# Altium schematic sheet RS485.SchDoc: Name project title here
size A3; Organization: Krakul OÜ; Address1: Kaare tee 3, lubja; Address2: viimsi vald; Address3: harju maakond; Address4: Estonia 74010; DocumentNumber: No here; Revision: 0; SheetNumber: 3; SheetTotal: 7
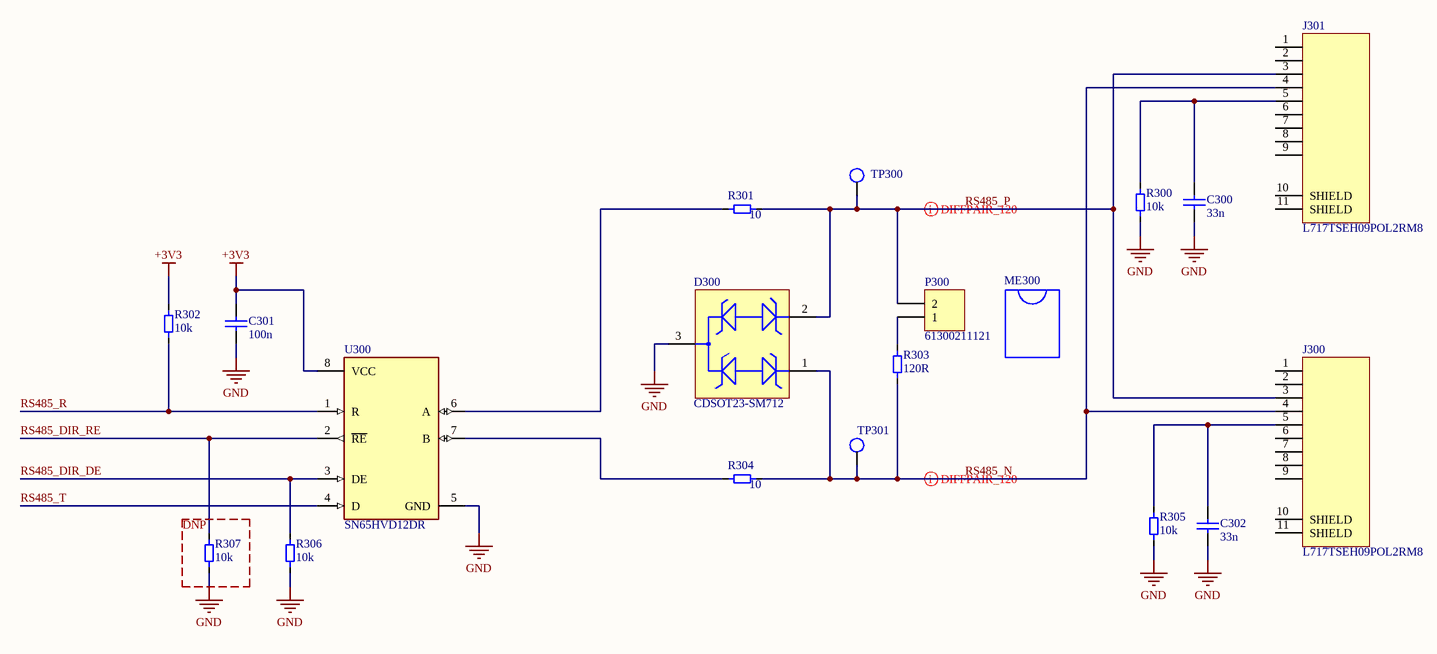
[diagram p0: RS485.SchDoc]

## Parts
C300  33n  [MLCC_0805_M]
C301  100n  [MLCC_0402_M]
C302  33n  [MLCC_0805_M]
D300  CDSOT23-SM712  [FP-SOT23-MFG]
J300  L717TSEH09POL2RM8  [L717TSEH09POL2RM8-Footprint-1]
J301  L717TSEH09POL2RM8  [L717TSEH09POL2RM8-Footprint-1]
ME300  SNT-100-BK-T-H  [SNT-100-BK-T-H-Footprint-1]  (value not drawn)
P300  61300211121  [61300211121]
R300  10k  [Resistor_0603_M]
R301  value 10  [Resistor_0603_M]  (hidden comment: CRCW0603010RJNEAHP)
R302  10k  [Resistor_0603_M]
R303  120R  [Resistor_0805_M]
R304  value 10  [Resistor_0603_M]  (hidden comment: CRCW0603010RJNEAHP)
R305  10k  [Resistor_0603_M]
R306  10k  [Resistor_0603_M]
R307  10k  [Resistor_0603_M]
TP300  Testpoint 1mm  [Testpoint 1mm]  (value not drawn)  (no BOM)
TP301  Testpoint 1mm  [Testpoint 1mm]  (value not drawn)  (no BOM)
U300  SN65HVD12DR  [FP-D0008A-IPC_B]

## Blocks framed on the sheet
DNP: R307

## Nets
+3V3: C301.2 R302.2 U300.8(VCC)
GND: C300.1 C301.1 C302.1 D300.3 R300.1 R305.1 R306.1 R307.1 U300.5(GND)
RS485_DIR_DE: R306.2 U300.3(DE)
RS485_DIR_RE: R307.2 U300.2(~{RE})
RS485_N: D300.1 J300.4 J301.4 R303.1 R304.2 TP301.1
RS485_P: D300.2 J300.3 J301.3 P300.2 R301.2 TP300.1
RS485_R: R302.1 U300.1(R)
RS485_T: U300.4(D)
NetC300_2: C300.2 J301.5 R300.2
NetC302_2: C302.2 J300.5 R305.2
NetP300_1: P300.1 R303.2
NetR301_1: R301.1 U300.6(A)
NetR304_1: R304.1 U300.7(B)

Not connected (* = marked no-connect by the designer): J300 1 2 6 7 8 9 10(SHIELD) 11(SHIELD); J301 1 2 6 7 8 9 10(SHIELD) 11(SHIELD)

## Layout directives
differential pair: RS485_N, RS485_P

## Notes on the sheet
- Title:
- Date:
- Last modified:
- Project:
- Sheet
- Time:
- of
- Size:
- A3
- Engineer:
- Revision:
- Revision date:
- Checked by:

## Library data of the parts
C300 C302 = CMP-001-1076-2: MLCC, 0805, 33n, 10%, 50V, X7R; Manufacturer: Any; Capacitor Type: Ceramic; Value: 33nF; Case/Package: 0805; Part number: MLCC, 0805, 33n, 10%, 50V, X7R; Dielectric: X7R; Voltage: 50V; Tolerance: 10%; RoHS: Yes; Mount: SMD
C301 = CMP-001-1256-2: MLCC, 0402, 100n, 10%, 10V, X5R; Manufacturer: Any; Capacitor Type: Ceramic; Value: 100nF; Case/Package: 0402; Part number: MLCC, 0402, 100n, 10%, 10V, X5R; RoHS: Yes; Tolerance: 10%; Mount: SMD; Voltage: 10V; Dielectric: X5R
D300 = CMP-ROOT-00649-3: BOURNS - CDSOT23-SM712 - Transient Voltage Suppressor, TVS, CDSOT23 Series, Unidirectional, 12 V, SOT-23, 3, 13.3 V; Manufacturer: Bourns Inc.; Power Line Protection: No; Peak Pulse Current: 17A; Number of Channels: 2; Peak Pulse Power: 400W; Reverse Standoff Voltage: 12V; Reverse Breakdown Voltage: 13.3V; Test Current: 1mA; Capacitance: 75pF; Direction: Bidirectional; Leakage Current: 20uA; Max Power Dissipation: 600W; ESD Protection: Yes; Clamping Voltage: 26V; Element Configuration: Dual; Max Surge Current: 30A; Polarity: Bidirectional,Unidirectional; Width: 0.055inch; Packaging: Tape and Reel; Termination: SMD/SMT; Height: 1.11mm; Radiation Hardening: No; Max Operating Temperature: 150°C; Length: 3.04mm; Case/Package: SOT-23; Number of Pins: 3; Min Breakdown Voltage: 13.3V; RoHS: Yes; Part number: CDSOT23-SM712; Depth: 1.4mm; Number of Bidirectional Channels: 2; REACH SVHC: No SVHC; Min Operating Temperature: -55°C; Package Quantity: 1; Resistor Type: Zener; Contact Plating: Tin; Mount: Surface Mount; Breakdown Voltage: 13.3V; Number of Elements: 2; Max Breakdown Voltage: 13.3V; Working Voltage: 12V; Max Reverse Leakage Current: 20uA; Power Dissipation: 400W
J300 J301 = CMP-ROOT-01058-3: Conn D-Subminiature PIN 9 POS 1.37mm Solder ST Thru-Hole 9 Terminal 1 Port; Manufacturer: Amphenol ICC; Gender: Male, Pins; Mount: TH; Part number: L717TSEH09POL2RM8; Pins: 9; RoHS: Yes; Orientation: Straight, Vertical
ME300 = CMP-ROOT-01069-1: SNT - Samtec 2.54mm Jumper Link / Shunt; Contact Resistance: 5mR; Max Current Rating: 2.5A; Number of Contacts: 2; Case/Package: 2,54 mm jumper; Manufacturer: Samtec; Mount: THT; Part number: SNT-100-BK-T-H; Pins: 0; RoHS: Yes; Color: Black; Contact Material: Bronze; Contact Plating: Tin; Depth: 2.54mm; Flammability Rating: UL94 V-0; Height: 0.24inch; Housing Color: Black; Housing Material: Polyester; Length: 50.8mm; Max Operating Temperature: 90°C; Min Operating Temperature: -40°C; Number of Rows: 1; Orientation: Straight; Package Quantity: 1; Packaging: Bulk; Pitch: 2.54mm; Radiation Hardening: No; Reach SVHC Compliant: No; RoHS Compliant: Yes; Series: SNT
P300 = CMP-001-1357-2: Headers & Wire Housings WR-PHD 2.54mm 2Pin THT Header; Manufacturer: Wurth; Number of Contacts: 2; Current Rating: 3A; Voltage Rating: 250V; Gender: Male; Connector Type: Male Pin; Pitch: 0.1inch; Color: Black; Pins: 2; Max Operating Temperature: 125°C; RoHS: Yes; Lead Free: Lead Free; Packaging: Bulk; Part number: 61300211121; Mount: Through Hole; Number of Positions: 2; Contact Material: Copper Alloy,Copper; Contact Mating Length: 0.236inch; Contact Plating: Gold; Housing Material: PBT; REACH SVHC: Unknown; Min Operating Temperature: -40°C; Contact Gender: Male; Number of Rows: 1; Termination: Through Hole
R300 R302 R305-R307 = CMP-001-0101-2: Resistor, 0603, 10k, 1%, 1/10W; Manufacturer: Any; Power: 100mW; Tolerance: 1%; Value: 10k; RoHS: Yes; Mount: SMD; Case/Package: 0603; Part number: Resistor, 0603, 10k, 1%, 1/10W
R301 R304 = CMP-0001-00279-2: 10R 0603 Pulse-proof 1/3W; Manufacturer: Vishay; Part number: CRCW060310R0JNEAHP; Power: 330mW; Tolerance: 5%; Voltage: 75V; Max Power Dissipation: 250mW; Case/Package: 0603; Mount: SMD; Pins: 2; RoHS: Yes; Lead Free: Lead Free; Max Operating Temperature: 155°C
R303 = CMP-001-1673-1: Resistor, 0805, 120R, 1%, 1/10W; Manufacturer: Any; Power: 100mW; Value: 120; Part number: Resistor, 0805, 120R, 1%, 1/10W; Tolerance: 1%; Mount: SMD; RoHS: Yes; Case/Package: 0805
TP300 TP301 = CMP-001-1238-1
U300 = CMP-ROOT-01068-1: 1/1 Transceiver Half RS422, RS485 8-SOIC; Manufacturer: TI; Data Rate: 1Mbps; Interface: RS-485; Max Supply Voltage: 3.6V; Min Supply Voltage: 3V; Number of Drivers: 1; Operating Supply Current: 15.5mA; Operating Supply Voltage: 3.3V; Simplex/Duplex: Half Duplex; Case/Package: SOIC-8; Mount: SMD; Part number: SN65HVD12DR; Pins: 8; RoHS: Yes; Lead Free: Lead Free; Logic Function: Transceiver; Max Operating Temperature: 85°C; Min Operating Temperature: -40°C; Mounting Technology: Surface Mount; Number of Receivers: 1; Number of Transceivers: 1; Number of Transmitters: 1; Package Quantity: 1; Packaging: Tape and Reel; Radiation Hardening: No; Reach SVHC Compliant: No; RoHS Compliant: Yes; Series: -; Supply Current: 15.5mA; Weight: 0.002561oz